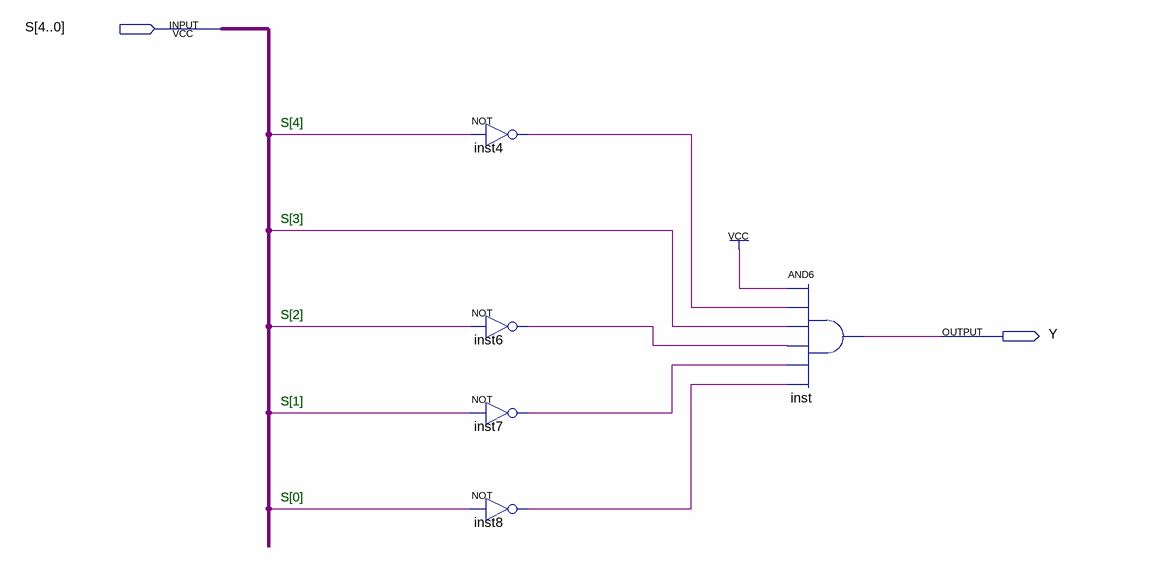
[diagram p0: schematic sheet]
// Quartus schematic S8.bdf as structural Verilog: 5 symbols, 2 pins
module S8 (
  input  [4:0] S,
  output Y
);

  wire inst4_out, inst6_out, inst7_out, inst8_out;

  not inst4 (inst4_out, S[4]);
  not inst6 (inst6_out, S[2]);
  not inst7 (inst7_out, S[1]);
  not inst8 (inst8_out, S[0]);
  and inst (Y, 1'b1, inst4_out, S[3], inst6_out, inst7_out, inst8_out);

  // Notes on the sheet:
  //   S[4]
  //   S[3]
  //   S[2]
  //   S[1]
  //   S[0]
endmodule
